# Altium project Keng Seng Task 2.PrjPcb
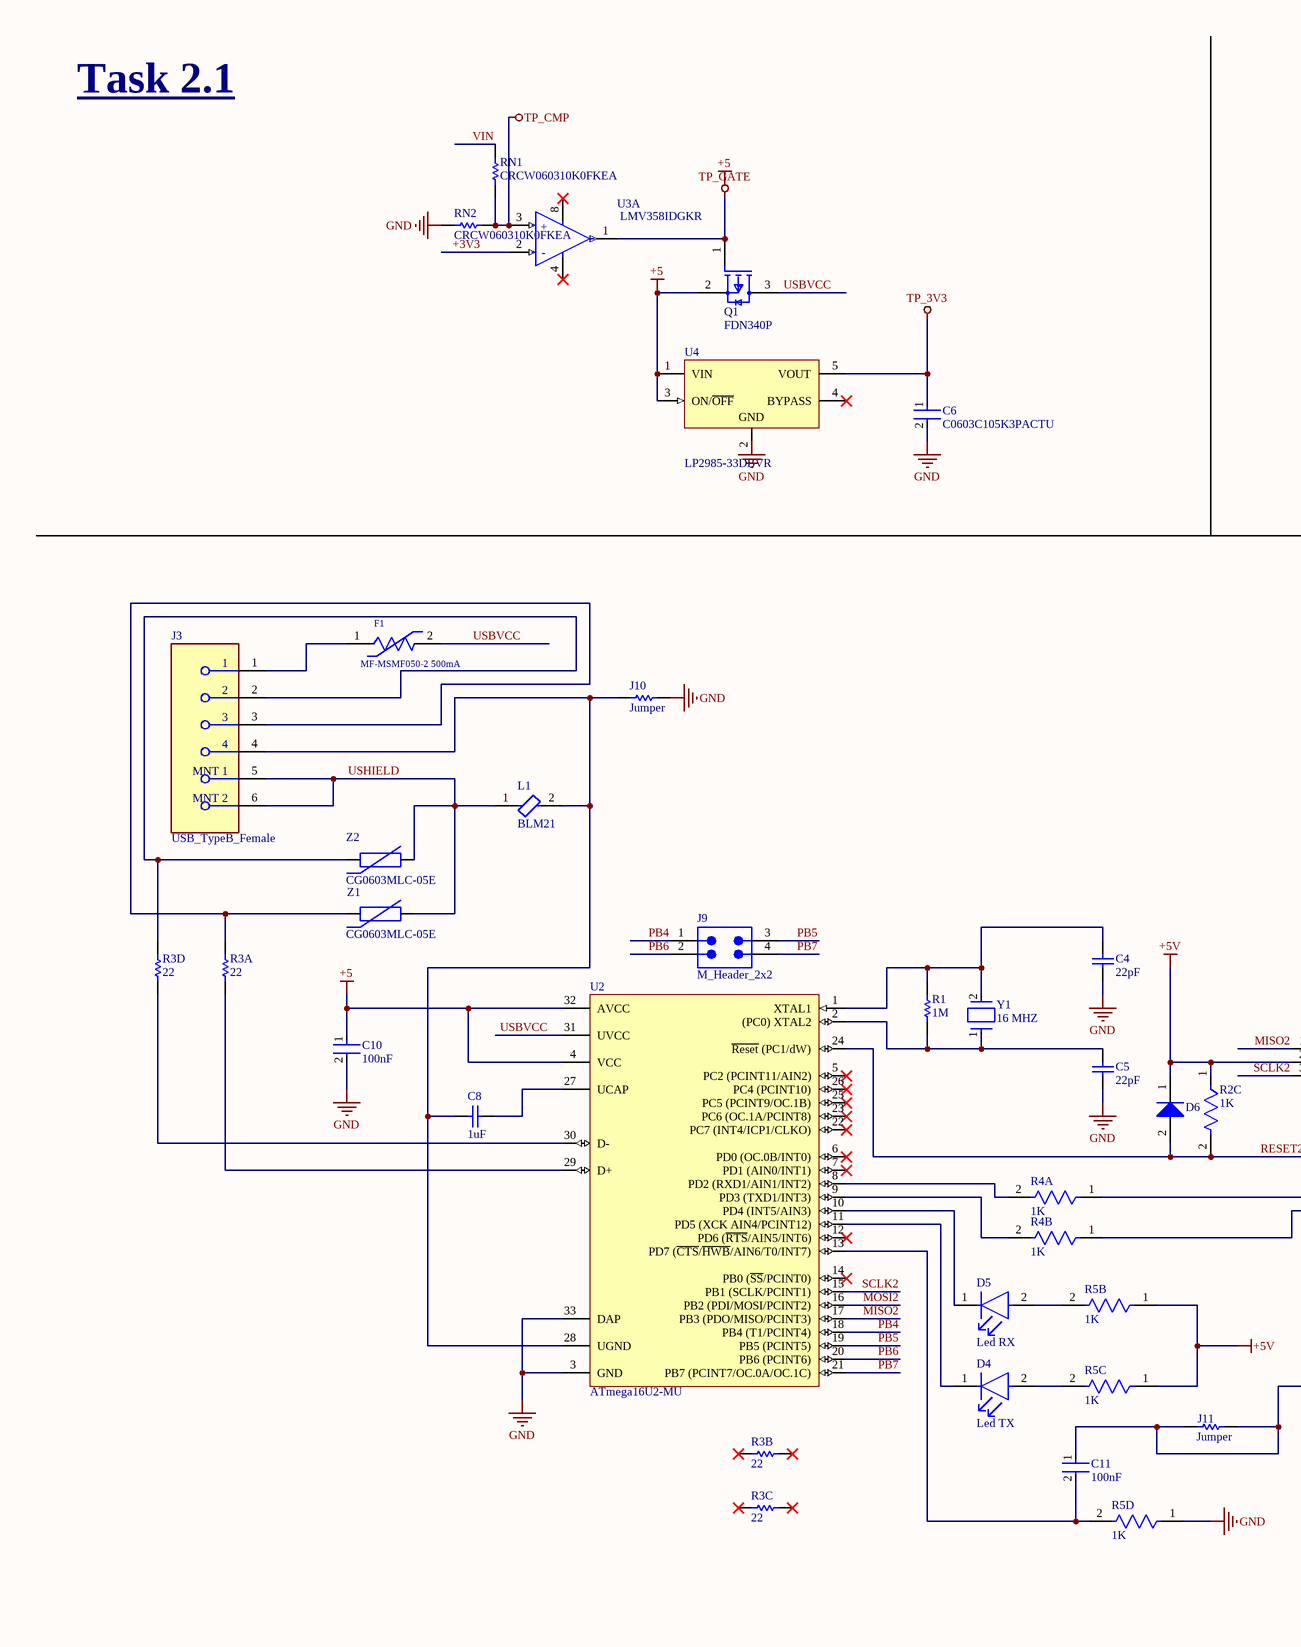
[diagram p0: Keng Seng Task 2.SchDoc, left]
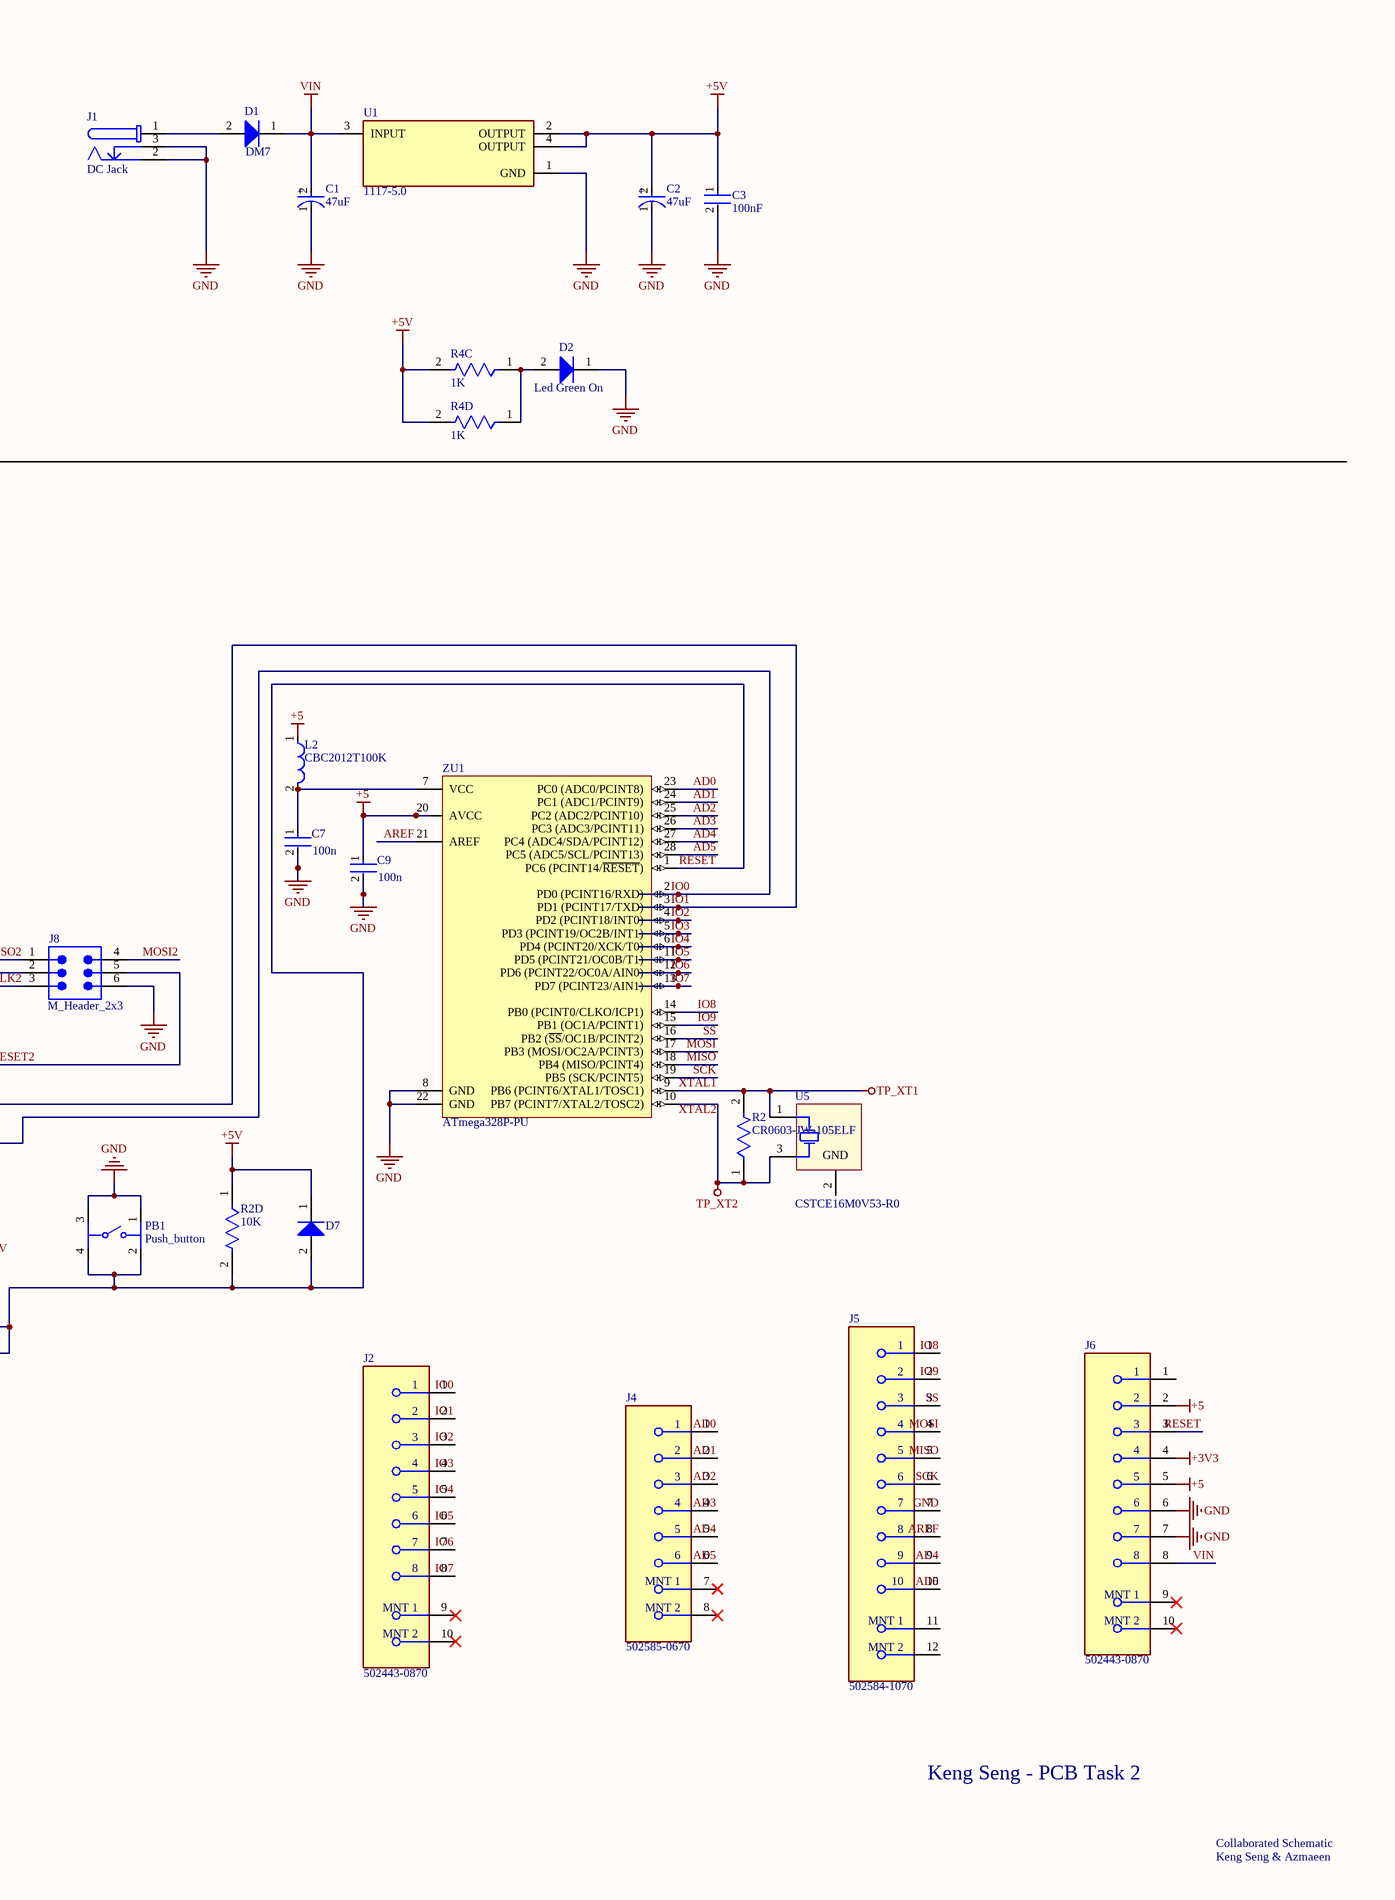
[diagram p1: Keng Seng Task 2.SchDoc, right]
1 sheet, 58 parts. Net scope: global (net labels, ports and power ports of the same name join across sheets).
Board file: Keng Seng Task 2.PcbDoc

## Sheet Keng Seng Task 2.SchDoc
size C; SheetNumber: 1; SheetTotal: 1

### Parts
C1  47uF  [FP-FPD-MFG]
C2  47uF  [FP-FPD-MFG]
C3  100nF  [FP-C0402-BB-MFG]
C4  22pF  [CAPC1608X90X35ML10T15]
C5  22pF  [CAPC1608X90X35ML10T15]
C6  C0603C105K3PACTU  [FP-C0603C105K3PACTU-MFG]
C7  100n  [FP-C0603-030-0_03-IPC_A]
C8  1uF  [CAPC2013X135X45LL10T25]
C9  100n  [FP-C0603-030-0_03-IPC_A]
C10  100nF  [FP-C0402-BB-MFG]
C11  100nF  [FP-C0402-BB-MFG]
D1  DM7  [ONSC-SOD-323-2-477-02_V]
D2  Led Green On  [ONSC-SOD-323-2-477-02_V]
D4  Led TX  [FP-LTST-C190GKT-MFG]
D5  Led RX  [FP-LTST-C190GKT-MFG]
D6  (no value)  [ONSC-SOD-323-2-477-02_V]
D7  (no value)  [ONSC-SOD-323-2-477-02_V]
F1  MF-MSMF050-2 500mA  [FP-MF-MSMF050-2-MFG]
J1  DC Jack  [694105309102]
J2  502443-0870  [FP-502443-0870-MFG]
J3  USB_TypeB_Female  [FP-1-1734346-1-MFG]
J4  502585-0670  [FP-502585-0670-MFG]
J5  502584-1070  [FP-502584-1070-MFG]
J6  502443-0870  [FP-502443-0870-MFG]
J8  M_Header_2x3  [66200621022]
J9  M_Header_2x2  [66200421022]
J10  Jumper  [RESC2013X50X30LL20T20]
J11  Jumper  [RESC2013X50X30LL20T20]
L1  BLM21  [FP-BLM21-0_2-t0_85-e0_5-MFG]
L2  CBC2012T100K  [FP-CB2012-IPC_A]
PB1  Push_button  [FP-PTS645SM43SMTR92LFS-MFG]
Q1  FDN340P  [FP-527AG-MFG]
R1  1M  [RESC3216X70X50NL05T20]
R2  CR0603-JW-105ELF  [FP-CR0603-IPC_A]
R2C  1K  [FP-CRCW0603-e3-MFG]
R2D  10K  [FP-CRCW0603-e3-MFG]
R3A  22  [RESC1005X40X25LL05T05]
R3B  22  [RESC1005X40X25LL05T05]
R3C  22  [RESC1005X40X25LL05T05]
R3D  22  [RESC1005X40X25LL05T05]
R4A  1K  [FP-CRCW0603-e3-MFG]
R4B  1K  [FP-CRCW0603-e3-MFG]
R4C  1K  [FP-CRCW0603-e3-MFG]
R4D  1K  [FP-CRCW0603-e3-MFG]
R5B  1K  [FP-CRCW0603-e3-MFG]
R5C  1K  [FP-CRCW0603-e3-MFG]
R5D  1K  [FP-CRCW0603-e3-MFG]
RN1  CRCW060310K0FKEA  [RESC1609X50X30NL8T20]
RN2  CRCW060310K0FKEA  [RESC1609X50X30NL8T20]
U1  1117-5.0  [FP-DCY0004A-IPC_A]
U2  ATmega16U2-MU  [32PG_N]
U3  LMV358IDGKR  [FP-DGK0008A-IPC_B]  (part A of 2)
U4  LP2985-33DBVR  [DBV0005A_M]
U5  CSTCE16M0V53-R0  [MURA-CSTCE_V-3_V]
Y1  16 MHZ  [FP-ABM7-MFG]
Z1  CG0603MLC-05E  [BOUR-CG0603-2_V]
Z2  CG0603MLC-05E  [BOUR-CG0603-2_V]
ZU1  ATmega328P-PU  [28P3]

### Nets
+3V3: J6.4 U3.2(1IN-)
+5: C9.1 C10.1 J6.2 J6.5 L2.1 Q1.2(S) U2.4(VCC) U2.32(AVCC) U4.1(VIN) U4.3(ON/~{OFF}) ZU1.20(AVCC)
+5V: C2.2(A) C3.1 D6.1(K) D7.1(K) J8.2 R2C.1 R2D.1 R4C.2 R4D.2 R5B.1 R5C.1 U1.2(OUTPUT) U1.4(OUTPUT)
GND: C1.1(C) C2.1(C) C3.2 C4.1 C5.1 C6.2 C7.2 C9.2 C10.2 D2.1(K) J1.2 J1.3 J5.7 J6.6 J6.7 J8.6 J10.1 PB1.1 PB1.3 R5D.1 RN2.1 U1.1(GND) U2.3(GND) U2.33(DAP) ZU1.8(GND) ZU1.22(GND)
TP_3V3: C6.1 U4.5(VOUT)
TP_CMP: RN1.1 RN2.2 U3.3(1IN+)
TP_GATE: Q1.1(G) U3.1(1OUT)
VIN: C1.2(A) D1.1(K) J6.8 RN1.2 U1.3(INPUT)
XTAL1: R2.2 U5.1(C1) ZU1.9(PB6_(PCINT6/XTAL1/TOSC1))  [also labelled TP_XT1]
XTAL2: R2.1 U5.3(C2) ZU1.10(PB7_(PCINT7/XTAL2/TOSC2))  [also labelled TP_XT2]
AD0: J4.1 ZU1.23(PC0_(ADC0/PCINT8))
AD1: J4.2 ZU1.24(PC1_(ADC1/PCINT9))
AD2: J4.3 ZU1.25(PC2_(ADC2/PCINT10))
AD3: J4.4 ZU1.26(PC3_(ADC3/PCINT11))
AD4: J4.5 J5.9 ZU1.27(PC4_(ADC4/SDA/PCINT12))
AD5: J4.6 J5.10 ZU1.28(PC5_(ADC5/SCL/PCINT13))
AREF: J5.8 ZU1.21(AREF)
IO0: J2.1 R4B.1 ZU1.2(PD0_(PCINT16/RXD))
IO1: J2.2 R4A.1 ZU1.3(PD1_(PCINT17/TXD))
IO2: J2.3 ZU1.4(PD2_(PCINT18/INT0))
IO3: J2.4 ZU1.5(PD3_(PCINT19/OC2B/INT1))
IO4: J2.5 ZU1.6(PD4_(PCINT20/XCK/T0))
IO5: J2.6 ZU1.11(PD5_(PCINT21/OC0B/T1))
IO6: J2.7 ZU1.12(PD6_(PCINT22/OC0A/AIN0))
IO7: J2.8 ZU1.13(PD7_(PCINT23/AIN1))
IO8: J5.1 ZU1.14(PB0_(PCINT0/CLKO/ICP1))
IO9: J5.2 ZU1.15(PB1_(OC1A/PCINT1))
MISO: J5.5 ZU1.18(PB4_(MISO/PCINT4))
MISO2: J8.1 U2.17(PB3_(PDO/MISO/PCINT3))
MOSI: J5.4 ZU1.17(PB3_(MOSI/OC2A/PCINT3))
MOSI2: J8.4 U2.16(PB2_(PDI/MOSI/PCINT2))
PB4: J9.1 U2.18(PB4_(T1/PCINT4))
PB5: J9.3 U2.19(PB5_(PCINT5))
PB6: J9.2 U2.20(PB6_(PCINT6))
PB7: J9.4 U2.21(PB7_(PCINT7/OC.0A/OC.1C))
RESET: C11.1 D7.2(A) J6.3 J11.1 J11.2 PB1.2 PB1.4 R2D.2 ZU1.1(PC6_(PCINT14/~{RESET}))
RESET2: D6.2(A) J8.5 R2C.2 U2.24(~{Reset}_(PC1/dW))
SCK: J5.6 ZU1.19(PB5_(SCK/PCINT5))
SCLK2: J8.3 U2.15(PB1_(SCLK/PCINT1))
SS: J5.3 ZU1.16(PB2_(~{SS}/OC1B/PCINT2))
USBVCC: F1.2 Q1.3(D) U2.31(UVCC)
USHIELD: J3.5(MNT_1) J3.6(MNT_2) L1.1 Z1.2 Z2.2
NetC4_2: C4.2 R1.2 U2.1(XTAL1) Y1.2
NetC5_2: C5.2 R1.1 U2.2((PC0)_XTAL2) Y1.1
NetC7_1: C7.1 L2.2 ZU1.7(VCC)
NetC8_1: C8.1 J3.4 J10.2 L1.2 U2.28(UGND)
NetC8_2: C8.2 U2.27(UCAP)
NetC11_2: C11.2 R5D.2 U2.13(PD7_(~{CTS}/~{HWB}/AIN6/T0/INT7))
NetD1_2: D1.2(A) J1.1
NetD2_2: D2.2(A) R4C.1 R4D.1
NetD4_1: D4.1(C) U2.11(PD5_(XCK_AIN4/PCINT12))
NetD4_2: D4.2(A) R5C.2
NetD5_1: D5.1(C) U2.10(PD4_(INT5/AIN3))
NetD5_2: D5.2(A) R5B.2
NetF1_1: F1.1 J3.1
NetJ3_2: J3.2 R3D.2 Z2.1
NetJ3_3: J3.3 R3A.1 Z1.1
NetR3A_2: R3A.2 U2.29(D+)
NetR3D_1: R3D.1 U2.30(D-)
NetR4A_2: R4A.2 U2.8(PD2_(RXD1/AIN1/INT2))
NetR4B_2: R4B.2 U2.9(PD3_(TXD1/INT3))

Not connected (* = marked no-connect by the designer): J2 9(MNT_1)* 10(MNT_2)*; J4 7(MNT_1)* 8(MNT_2)*; J5 11(MNT_1) 12(MNT_2); J6 1 9(MNT_1)* 10(MNT_2)*; R3B 1* 2*; R3C 1* 2*; U2 5(PC2_(PCINT11/AIN2))* 6(PD0_(OC.0B/INT0))* 7(PD1_(AIN0/INT1))* 12(PD6_(~{RTS}/AIN5/INT6))* 14(PB0_(~{SS}/PCINT0))* 22(PC7_(INT4/ICP1/CLKO))* 23(PC6_(OC.1A/PCINT8))* 25(PC5_(PCINT9/OC.1B))* 26(PC4_(PCINT10))*; U3 4(GND)* 8(VCC+)*; U4 2(GND) 4(BYPASS)*; U5 2(GND)

### Notes on the sheet
- Task 2.1
- Keng Seng - PCB Task 2
- Keng Seng & Azmaeen
- Collaborated Schematic
- Labels drawn without touching a wire or pin: +5, GND
- (in symbol CMP-2000-06216-2) +
- (in symbol CMP-2100-03651-2, part A) +; -

### Library data of the parts
C1 C2 = CMP-2000-06216-2: CAP ALUM 47UF 20% 35V SMD; Life (Hours): 2000Hour; Leakage Current: 3uA; Dissipation Factor: 0.12%; Material: Aluminium; Ripple Current (AC): 300mA; ESR (Equivalent Series Resistance): 260mR; Construction: Cylindrical; Contact Plating: Tin; Termination: SMD/SMT; RoHS Compliant: Yes; Voltage Rating (DC): 35V; Package Quantity: 1; Tolerance: 20%; Mount: Surface Mount; Diameter: 6.3mm; Lead Free: Lead Free; Number of Pins: 2; Radiation Hardening: No; Series: FP; REACH SVHC: No SVHC; Length: 5.8mm; Height - Seated (Max): 0.228inch; Capacitance: 47uF; Packaging: Tape and Reel; Voltage Rating: 35V; Min Operating Temperature: -55°C; Voltage: 35V; Case/Package: Radial; Max Operating Temperature: 105°C; Ripple Current: 300mA; Height: 5.8mm; Lead Pitch: 1.8mm
C3 C10 C11 = CMP-2008-02046-2: CAP CER 0.1UF 10V X5R 0402; Manufacturer: Kemet; Manufacturer Part Number: C0402C104K8PACTU; Material: Ceramic; Capacitance: 0.10 μF; Temperature Coefficient: 15%; Tolerance: 0.1; Value: 0.10 μF; Package: C0402-BB; Temperature: -55°C to +125°C; ComponentLink2Description: Datasheet; Temperature Characteristic: X5R; Device Class L1: Passive Components; Height: 0.55mm; Lead Free: Yes; ComponentLink2URL: https://content.kemet.com/datasheets/KEM_C1002_X7R_SMD.pdf; Device Class L2: Capacitors; Temperature Range Low: -55°C; Temperature Range High: +125°C; RoHS: TRUE; Octopart: https://octopart.com/c0402c104k8pactu-kemet-140039; Automotive: No; Mouser Description: Capacitor 100 nF 10 VDC 0402; Category: Cap; Voltage Rating: 10 V; Digikey Description: CAP CER 0.1UF 10V X5R 0402; Ipc Land Pattern Name: CAPC10050X50; Device Class L3: Ceramic Capacitors
C4 C5 = CMP-2000-04945-1: Chip Capacitor, 22 pF, +/- 5%, 50 V, -55 to 125 degC, 0603 (1608 Metric), RoHS, Tape and Reel; Manufacturer: Murata; Rated Voltage: 50V; Dielectric: C0G; Capacitance: 22pF; Manufacturer URL: http://www.murata.com/; Datasheet Version: Jul-06; Package Reference: 603; Tolerance (%): ±5%; Case Size/Dimension: 0603; Package Description: 2-Pin Surface Mount Device, Body 1.6 x 0.8 mm; Datasheet URL: https://datasheet.ciiva.com/11786/0900766b807a1cab-11786398.pdf
C6 = CMP-2006-02216-3: CAP CER 1UF 25V X5R 0603; Dielectric Material: Ceramic; Tolerance: 10%; Contact Plating: Tin; Number of Pins: 2; Lead Free: Lead Free; Depth: 0.8mm; Length: 1.6mm; Mount: Surface Mount; Case Code (Metric): 1608; Max Operating Temperature: 85°C; Voltage: 25V; Voltage Rating (DC): 25V; REACH SVHC: No SVHC; Height: 0.8mm; Series: C0603C; Case/Package: 0603; Case Code (Imperial): 0603; Capacitance: 1uF; RoHS Compliant: Yes; Dielectric: X5R; Packaging: Tape and Reel; Construction: Flat; Thickness: 0.034inch; Voltage Rating: 25V; Radiation Hardening: No; Width: 0.031inch; Min Operating Temperature: -55°C; Termination: SMD/SMT; Package Quantity: 4000
C7 C9 = CMP-08246-003527-1: Multilayer Ceramic Capacitors 100pF ±5% 50V C0G SMD 0201; Insulation Resistance: 10GR; Package Quantity: 1; Dielectric Material: Ceramic; Packaging: Tape and Reel; Thickness: 0.013inch; Mount: Surface Mount; Voltage Rating (DC): 50V; Construction: Flat; Series: C; Tolerance: 5%; Min Operating Temperature: -55°C; Weight: 6E-06oz; Dielectric: C0G; Length: 0.6mm; Termination: SMD/SMT; Voltage Rating: 50V; Voltage: 50V; Height: 0.3mm; Capacitance: 100pF; RoHS Compliant: Yes; Case Code (Imperial): 0201; Max Operating Temperature: 125°C; Case/Package: 0201; Lead Free: Lead Free; Width: 0.012inch; Number of Pins: 2; Case Code (Metric): 0603; Depth: 0.3mm
C8 = CMP-1036-04761-2: Manufacturer: Murata; Part Number: GRM21BR71H105KA12L
D1 D2 D6 D7 = CMP-1055-00462-1: Schottky Barrier Diode, 2-Pin SOD-323, Pb-Free, Tape and Reel; PartNumber: BAT54HT1G; Manufacturer: On Semiconductor; Configuration: Single; trr Max (ns): 5; IFSM Max (A): 0.6; ComponentLink3URL: http://www.onsemi.com/pub_link/Collateral/477-02.PDF.1; PackageDescription: 2-Pin SOD, Body 1.7 x 1.25 mm; ComponentLink2URL: http://www.onsemi.cn/pub_link/Collateral/BAT54HT1-D.PDF; ComponentLink3Description: Package Specification; ComponentLink2Description: Datasheet; DatasheetVersion: Rev. 6; PackageReference: SOD-323-2-477-02; RoHS: TRUE; ComponentLink1URL: http://www.onsemi.com/; Packing: Tape and Reel; Mounting Technology: Surface Mount; ComponentLink1Description: Manufacturer URL; PackageVersion: Rev. H, 03/2007
D4 D5 = CMP-22017-000005-2: LED GREEN CLEAR CHIP SMD; Dominant Wavelength: 569nm; Reverse Voltage: 5V; Lens Color: Colorless; Viewing Angle: 130°; Voltage: 2V; Forward Current: 30mA; Power Dissipation: 100mW; Luminous Intensity: 6mcd; Number of LEDs: 1; Forward Voltage: 2.1V; Wavelength: 565nm; Test Current: 10mA; Min Operating Temperature: -55°C; Lens Style: Clear; Mount: Surface Mount; Width: 0.8mm; Packaging: Tape and Reel; Lens Transparency: Clear; Case Code (Metric): 1608; Depth: 0.8mm; Case Code (Imperial): 0603; Case/Package: 0603; Number of Pins: 2; Max Operating Temperature: 85°C; Lead Free: Lead Free; Number of Elements: 1; Length: 1.6mm; Height: 0.8mm; Package Quantity: 1; Power Rating: 100mW; Radiation Hardening: No; Illumination Color: Green; Color: Green
F1 = CMP-2100-03653-2: PTC RESET FUSE 15V 500MA 1812; Manufacturer: Bourns; Value: 0.15-1Ω; Trip Current: 1A; Automotive Grade: Grade 3; Trip Time: 0.15s; Current Rating: 100A; Hold Current: 0.5A; Height: 0.85mm; Package: 1812; Voltage Rating: 15V; Temperature Range High: +85°C; Device Class L2: PTC Resettable Fuses; Lead Free: Yes; ComponentLink2URL: http://www.bourns.com/docs/Product-Datasheets/mfmsmf.pdf; Ambient Temperature Range High: +85°C; Mouser Description: PTC Resettable Fuse 0.5A(hold) 1A(trip) 15V 100A 0.8W 0.15s 0.15Ohm SMD Solder Pad 1812 T/R; Digikey Description: PTC RESET FUSE 15V 500MA 1812; Manufacturer Part Number: MF-MSMF050-2; Resistance: 0.15-1Ω; Category: Fuse; ComponentLink2Description: Datasheet; Automotive: Yes; Temperature Range Low: -40°C; RoHS: TRUE; Device Class L1: Circuit Protection; Temperature: -40°C to +85°C; Octopart: https://octopart.com/mf-msmf050-2-bourns-28047; Ambient Temperature Range Low: -40°C; Device Class L3: unset
J1 = CMP-1502-00187-2: NexarPartId: 52645182; Current Rating: 5.5A; Insulation Resistance: 100MΩ; Gender: Male; Connector Type: Power; Shielding: Shielded; Voltage Rating (DC): 20V; Contact Plating: Tin; Contact Gender: Female; Housing Material: Polyamide; Flammability Rating: UL94 V-0; RoHS: Compliant; Termination: Through Hole; Min Operating Temperature: -40°C; REACH SVHC: Unknown; Operating Supply Voltage: 20V; Voltage Rating: 20V; Mount: Through Hole; Max Operating Temperature: 85°C; Color: Black; Packaging: Tape and Reel
J2 J6 = CMP-00257-08030873-1: 502443-0870 2.00mm Pitch CLIK-Mate Wire-to-Board PCB Receptacle, Single Row, Vertical, 8 Circuits; Manufacturer Lifecycle Status: ACTIVE; Connector Type: Forked, Receptacle; Max Voltage Rating (DC): 250V; Number of Contacts: 8; Contact Resistance: 20mΩ; Plating: Tin; Current Rating: 3A; Glow Wire Compliant: Non-compliant; Pitch: 2mm; Insulation Resistance: 1GΩ; Flammability Rating: UL94 V-0; Mount: Surface Mount; Orientation: Vertical; Length: 20mm; Max Voltage Rating (AC): 250V; Contact Plating: Tin; Number of Positions: 8; NexarPartId: 8030873; Radiation Hardening: No; Lifecycle Status: Production; Termination: Solder; Housing Material: Thermoplastic; Voltage Rating (AC): 250V; Housing Color: Natural; Material: Polybutylene; Fastening Type: Latch; Depth: 6.85mm; Gender: Receptacle; Country of Origin: JP; Min Operating Temperature: -25°C; Color: Natural; Contact Gender: Female; Number of Rows: 1; Number of Pins: 8; RoHS: Compliant; Number of Circuits: 8; Packaging: Cut Tape; Schedule B: 8536694040; REACH SVHC: Unknown; Contact Material: Copper; Max Operating Temperature: 85°C
J3 = CMP-03360-000002-1: CONN RCPT USB2.0 TYPEB 4P SMD RA; Manufacturer: TE; Manufacturer Part Number: 1-1734346-1; Conn Orientation: Right Angle; Shielding: true; Number Of Contacts: 4; Voltage Rating: 30V; Standoff Height: 0mm; Current Rating: 1A; Is Female: yes; Pitch: 1.25mm; Digikey Description: CONN RCPT USB2.0 TYPEB 4P SMD RA; Mouser Description: USB Connectors R/A SMT B W/post BLK; RoHS: TRUE; Temperature Range Low: 0°C; Automotive: No; Device Class L3: unset; Contact Material: Gold,Nickel; Temperature: 0°C to +50°C; ComponentLink2Description: Datasheet; Octopart: https://octopart.com/1-1734346-1-te+connectivity-43171491; Device Class L2: USB Connectors; Device Class L1: Connectors; Height: 11.25mm; Usb Standard: USB 2.0; ComponentLink2URL: https://upverter.com/datasheet/fa2984cd0f06f842a1fb894b40a37fa21ddb7ad0.pdf; Package: 1-1734346-1; Lead Free: Yes; Temperature Range High: +50°C; Category: Conn
J4 = CMP-04776-000378-1: CONN RCPT 6POS 0.059 TIN SMD R/A; Number of Circuits: 6; Voltage Rating: 100V; Connector Type: Receptacle; Pitch: 1.5mm; Glow Wire Compliant: Non-compliant; Contact Resistance: 20mR; Current Rating: 2A; Housing Material: Resin; Contact Material: Copper Alloy; Package Quantity: 1000; Contact Type: Center Strip Contact; Depth: 7.3mm; Contact Plating: Tin; Case/Package: SIL; Radiation Hardening: No; Contact Gender: Female; Gender: Receptacle; Orientation: Right Angle; Length: 13.3mm; Number of Rows: 1; Max Operating Temperature: 85°C; Termination: Solder; Insulation Material: Resin; Mount: Surface Mount; Contact Finish - Mating: TIN; Packaging: Tape and Reel; Flammability Rating: UL94 V-0; Number of Contacts: 6; Fastening Type: Latch; Housing Color: Beige; Insulation Color: Beige; Series: CLIK-Mate™ 502585; Min Operating Temperature: -40°C; Number of Positions: 6; Color: Beige
J5 = CMP-00257-18669480-1: 502584-1070 1.5 W/B Sgl ST RecAssy10CktEmbsTpPkg; Manufacturer Lifecycle Status: ACTIVE; Pitch: 1.5mm; Gender: Receptacle; Connector Type: Center Strip Contact, Receptacle; Number of Circuits: 10; Voltage Rating: 100V; Current Rating: 2A; Glow Wire Compliant: Non-compliant; Min Operating Temperature: -40°C; Housing Material: Resin; NexarPartId: 18669480; RoHS: Compliant; Height: 7.5mm; Depth: 6.35mm; Case/Package: SIL; Max Operating Temperature: 85°C; Number of Pins: 10; Contact Plating: Tin; Housing Color: Beige; Contact Material: Copper, Tin; Mount: Surface Mount; Orientation: Vertical; Lifecycle Status: Production; REACH SVHC: Unknown; Number of Rows: 1; Country of Origin: JP; Length: 19.3mm; Number of Contacts: 10; Contact Gender: Female; Fastening Type: Latch; Number of Positions: 10; Packaging: Cut Tape; Radiation Hardening: No; Termination: Solder; Color: Beige
J8 = CMP-1502-00366-2: NexarPartId: 22865267; Row Spacing: 2.9972mm; Pitch: 3mm; Gender: Male; Operating Supply Voltage: 250V; Insulation Resistance: 1GΩ; Current Rating: 5A; Contact Resistance: 10mΩ; Number of Positions: 6; Connector Type: Male Pin, Socket; Number of Pins: 6; Width: 12.7mm; Fastening Type: Latch; Lead Pitch: 3mm; Length: 12.7mm; Contact Plating: Tin; Contact Material: Copper; Housing Material: Nylon; Height: 8.9mm; REACH SVHC: Unknown; Color: Black; Termination: Solder; Max Operating Temperature: 105°C; Mount: Through Hole; RoHS: Compliant; Number of Contacts: 6; Min Operating Temperature: -40°C; Number of Rows: 2
J9 = CMP-1502-00365-2: NexarPartId: 22865266; Pitch: 3mm; Number of Positions: 4; Current Rating: 5A; Gender: Male; Row Spacing: 2.9972mm; Contact Resistance: 10mΩ; Connector Type: Male Pin, Socket; Insulation Resistance: 1GΩ; Operating Supply Voltage: 250V; Min Operating Temperature: -40°C; Width: 9.7mm; Max Operating Temperature: 105°C; Housing Material: Nylon; Mount: Through Hole; Number of Contacts: 4; REACH SVHC: Unknown; Contact Plating: Tin; Termination: Solder; Height: 8.9mm; Number of Rows: 2; Lead Pitch: 3mm; Color: Black; Length: 9.7mm; RoHS: Compliant; Contact Material: Copper; Fastening Type: Ramp; Number of Pins: 4
J10 J11 = CMP-2001-04896-1: Manufacturer: Vishay Dale; Part Number: CRCW08050000Z0EA
L1 = CMP-0686-00639-3: Chip Ferrite Bead, 0805, 600Ω @ 100MHz, 0.2Ω, 25%, 700mA; Material: Steel; DC Current: 200mA; Impedance: 600R; Current Rating: 600mA; Number of Circuits: 1; Shielding: Unshielded; DC Resistance (DCR): 210mR; Temperature Coefficient: 10ppm/°C; Conductor Material: Copper; Radiation Hardening: No; Test Frequency: 100MHz; Height: 0.85mm; Max Current Rating: 700mA; REACH SVHC: No SVHC; Case Code (Metric): 2012; Max DC Current: 200mA; Min Operating Temperature: -55°C; ESR (Equivalent Series Resistance): 600R; Case/Package: 0805; Tolerance: 25%; Number of Pins: 2; Depth: 1.25mm; Lead Free: Lead Free; Frequency: 100MHz; Length: 2mm; Package Quantity: 1; Max Operating Temperature: 125°C; Case Code (Imperial): 0805; Width: 1.25mm; Core Material: Ferrite; RoHS Compliant: Yes; Termination: SMD/SMT; Number of Lines: 1; Packaging: Tape and Reel
L2 = CMP-14484-000331-1: SMD Inductors 10uH ±10% 0.34A 1.56Ω 0805; Saturation Current: 240mA; Current Rating: 340mA; Shielding: Unshielded; Self Resonant Frequency: 40MHz; DC Resistance (DCR): 1.56R; Core Material: Ferrite; Test Frequency: 2.52MHz; Halogen Free: Halogen Free; Min Operating Temperature: -40°C; Max Operating Temperature: 105°C; Package Quantity: 3000; Tolerance: 10%; Height: 1.25mm; Packaging: Tape and Reel; Case/Package: 0805; Series: CB; Termination: SMD/SMT; Case Code (Metric): 2012; Inductance: 10uH; Depth: 1.45mm; Height - Seated (Max): 0.057inch; Resistor Type: Wirewound; Case Code (Imperial): 0805; Max DC Current: 340mA; Width: 0.049inch; Radiation Hardening: No; Mount: Surface Mount; Inductance Tolerance: 10%; Length: 0.079inch
PB1 = CMP-2000-05160-2: SWITCH TACTILE SPST-NO 0.05A 12V; Contact Resistance: 100mR; Throw Configuration: SPST; Illumination Type: Non-Illuminated; Mechanical Life: 100000Cycles; Current Rating: 50mA; Switch Function: Off-Mom; Actuator Length: 0.85mm; Actuator Material: Nylon; Actuator Type: Standard; Operating Force: 160gf; Min Operating Temperature: -20°C; REACH SVHC: No SVHC; Termination: Gull Wing; Case/Package: SMD/SMT; Packaging: Tape and Reel; Mount: Surface Mount; Voltage Rating (DC): 12V; Orientation: Straight; Lead Free: Lead Free; Contact Material: Silver; Color: Black; Max Current Rating: 50mA; Contact Plating: Silver; Depth: 9mm; Package Quantity: 1; Max Voltage Rating (DC): 12V; Length: 6mm; Max Operating Temperature: 60°C
Q1 = CMP-2100-03638-2: MOSFET P-CH 20V 2A SSOT3; Fall Time: 11ns; Rise Time: 9ns; Voltage Rating (DC): -20V; Power Dissipation: 500mW; Nominal Vgs: -800mV; Current Rating: -2A; Gate to Source Voltage (Vgs): 8V; Rds On Max: 70mR; Turn-Off Delay Time: 27ns; Element Configuration: Single; Number of Elements: 1; Input Capacitance: 779pF; Drain to Source Resistance: 60mR; Turn-On Delay Time: 10ns; Package Quantity: 1; Mount: Surface Mount; Case/Package: SOT-23; Min Operating Temperature: -55°C; REACH SVHC: No SVHC; Weight: 0.03g; Packaging: Tape and Reel; Threshold Voltage: -800mV; Max Operating Temperature: 150°C; Dual Supply Voltage: -20V; Termination: SMD/SMT; Drain to Source Voltage (Vdss): 20V; Height: 0.94mm; Length: 2.92mm; Contact Plating: Tin; Width: 3.05mm; Drain to Source Breakdown Voltage: -20V; Max Power Dissipation: 500mW; Continuous Drain Current (ID): 2A; Number of Pins: 3; Lead Free: Lead Free; Radiation Hardening: No; On-State Resistance: 70MR
R1 = CMP-2003-00541-1: Manufacturer: Panasonic; Part Number: ERJ-8GEY0R00V
R2 = CMP-1012-00146-2: Thick Film Chip Resistors 0603 1MΩ 0.1W 5% 200ppm/°C; Power Rating: 100mW; Resistance: 1MR; Voltage Rating: 50V; Thickness: 457um; Case Code (Metric): 1608; Features: Moisture Resistant; Packaging: Tape and Reel; Max Power Dissipation: 100mW; Composition: Thick Film; Military Standard: Not; Height: 0.022inch; Case/Package: 0603; Width: 0.031inch; Termination: SMD/SMT; Min Operating Temperature: -55°C; Package Quantity: 1; Length: 1.6mm; Case Code (Imperial): 0603; Temperature Coefficient: 200ppm/°C; Tolerance: 5%; Contact Plating: Tin; Depth: 0.8mm; Max Operating Temperature: 155°C; Number of Terminations: 2; Mount: Surface Mount; Radiation Hardening: No
R2C R2D R4A R4B R4C R4D R5B R5C R5D = CMP-1666-00003-5: RES Thick Film, 1kΩ, 1%, 0.1W, 100ppm/°C, 0603; Max Power Dissipation: 100mW; Voltage Rating: 75V; Resistance: 1kR; Max Operating Temperature: 155°C; Number of Pins: 2; Case Code (Imperial): 0603; Width: 0.033inch; Power Rating: 100mW; Number of Terminations: 2; Package Quantity: 10; Weight: 7.1E-05oz; Tolerance: 1%; Temperature Coefficient: 100ppm/°C; Military Standard: Not; Mount: Surface Mount; Voltage Rating (DC): 75V; Depth: 0.85mm; Composition: Thick Film; Radiation Hardening: No; Termination: SMD/SMT; Length: 1.55mm; Case Code (Metric): 1608; Contact Plating: Tin; Min Operating Temperature: -55°C; Packaging: Tape and Reel; Height: 0.45mm; Lead Free: Lead Free; Case/Package: 0603; Features: Automotive AEC-Q200
R3A R3B R3C R3D = CMP-2002-08382-1: Manufacturer: Vishay Dale; Part Number: CRCW040222R0FKED
RN1 RN2 = CMP-1666-00005-4: Chip Resistor, 10 KOhm, +/- 1%, 100 mW, -55 to 155 degC, 0603 (1608 Metric), RoHS, Tape and Reel; Manufacturer: Vishay Semiconductor; Voltage Rating: 75 V; Max Operating Temperature: 155 degC; PackageDescription: 2-Pin Surface Mount Device, Body 1.575 x 0.85 mm; ComponentLink1Description: Manufacturer URL; RoHSCompliant: true; PackageReference: 0603; REACH SVHC: Unknown; Length: 1.55 mm; DatasheetVersion: 06/2012; Packaging: Tape and Reel; Min Operating Temperature: -55 degC; Mounting Technology: Surface Mount; ComponentLink2URL: https://datasheet.ciiva.com/11809/0900766b80d98afc-11809037.pdf; Height: 0.45 mm; ComponentLink2Description: Datasheet; Package Quantity: 5000; ComponentLink1URL: http://www.vishay.com/
U1 = CMP-04917-000165-1: IC REG LINEAR 5V 800MA SOT223-4; Quiescent Current: 15mA; Reference Voltage: 5.2V; Number of Outputs: 1; Input Bias Current: 5mA; Polarity: Positive; Min Input Voltage: 6.4V; Output Type: Fixed; Dropout Voltage: 1.2V; Max Input Voltage: 15V; REACH SVHC: No SVHC; Radiation Hardening: No; Width: 3.7mm; Length: 6.7mm; Min Operating Temperature: -40°C; Packaging: Rail/Tube; Number of Regulators: 1; Package Quantity: 80; Output Current: 800mA; RoHS Compliant: Yes; Case/Package: SOT-223; Min Current Limit: 800mA; Number of Pins: 3; Output Voltage: 5V; Max Output Current: 800mA; Nominal Output Voltage: 5V; Lead Free: Lead Free; Series: -; Mount: Surface Mount; Max Operating Temperature: 125°C; Height: 1.7mm
U2 = CMP-0095-00115-3: 8-bit AVR Microcontroller, 2.7-5.5V, 16KB Flash, 512 Bytes EEPROM, 512 Bytes SRAM, 32-pin VQFN, Industrial Grade (-40°C to 85°C); ComponentLink1Description: Manufacturer URL; RevisionNote: Schematic symbol corrected; ComponentLink3URL: http://www.atmel.com/dyn/resources/prod_documents/7799S.pdf; ComponentLink2URL: http://www.atmel.com/dyn/resources/prod_documents/doc7799.pdf; PackageReference: 32PG; DatasheetVersion: revD, Nov-2010; PartNumber: ATmega16U2-MU; PackageVersion: revA, Oct-2008; Code_JEDEC: MO-220WHHD-2; PackageDescription: 32-Pin Quad Flat No-Lead (QFN) Sawn,  5 x 5 x 1.0 mm Body, Pitch 0.50 mm, 3.60mm Exposed Pad; ComponentLink2Description: ATmega8U2/16U2/32U2 Datasheet; ComponentLink1URL: http://www.atmel.com/; ComponentLink3Description: ATmega8U2/16U2/32U2 Summary
U3 = CMP-2100-03651-2: IC OPAMP GP 2 CIRCUIT 8VSSOP; Operating Supply Current: 210uA; Number of Channels: 2; Common Mode Rejection Ratio: 50dB; Input Offset Voltage (Vos): 7mV; Slew Rate: 1V/µs; Output Current: 160mA; Nominal Supply Current: 440uA; Voltage Gain: 100dB; Input Bias Current: 250nA; Gain Bandwidth Product: 1MHz; Min Supply Voltage: 2.7V; Max Supply Voltage: 5.5V; Mount: Surface Mount; Packaging: Tape and Reel; Length: 3mm; Package Quantity: 1; Min Operating Temperature: -40°C; Width: 3mm; Height: 0.97mm; Max Operating Temperature: 125°C; REACH SVHC: No SVHC; Radiation Hardening: No; Power Supply Rejection Ratio (PSRR): 50dB; Lead Free: Lead Free; Case/Package: MSOP; Contact Plating: Gold; Number of Circuits: 2; Unity Gain Bandwidth Product: 1MHz; Number of Pins: 8; Bandwidth: 1MHz; Output Current per Channel: 160mA; Number of Amplifiers: 2; Number of Elements: 2
U4 = CMP-0758-00080-2: Single Output Low Noise LDO, 150 mA, Fixed 3.3 V Output, 1.5% Tolerance, 2.2 to 16 V Input, Low IQ, 5-Pin SOT-23 (DBV), -40 to 125 degC, Green (RoHS & no Sb/Br), Tape and Reel; Manufacturer: Texas Instruments; Vdo (Typ) (mV): 280; Accuracy (%): 1.5; Output Options: Fixed Output; Fixed Output Options (V): 3.3; Iout (Max) (A): 0.15; Iq (Typ) (mA): 0.85; ComponentLink3Description: Package Specification; Packing: Tape and Reel; ComponentLink3URL: http://www.ti.com/litv/pdf/mpds018j; Vin (V): 2.2 to 16; Mounting Technology: Surface Mount; ComponentLink1URL: http://www.ti.com/; PartNumber: LP2985-33DBVR; PackageReference: DBV0005A; ComponentLink2URL: http://www.ti.com/lit/ds/symlink/lp2985-50.pdf; RoHS: TRUE; ComponentLink2Description: Datasheet; PackageVersion: 4073253-4/L; Operating Temperature Range (degC): -40 to 125; DatasheetVersion: SLVS522N; ComponentLink1Description: Manufacturer URL; PackageDescription: 5-Pin Plastic Small Outline, Body 2.9 x 1.6 mm, Pitch 0.95 mm
U5 = CMP-0588-00001-2: Ceramic Resonator, 16 MHz with Built-in Capacitance, Thickness Expander Mode, Initial Frequency Tolerance +/- 0.5%, Load Capacity 15 pF, -20 to 80 degC, 3.2 x 1.3 x 1 mm SMD, RoHS, Reel; Manufacturer: Murata; Oscillating Frequency: 16 MHz; Load Capacity: 15 pF; PackageDescription: 3-Pin SMD, Body 3.2 x 1.3 mm, Pitch 0.95 mm; Mounting Technology: Surface Mount; ComponentLink1URL: http://www.murata.com/; RoHS: TRUE; Packing: Reel; Initial Frequency Tolerance: +/- 0.5%; PartNumber: CSTCE16M0V53-R0; ComponentLink2Description: Datasheet; DatasheetVersion: Rev. P16E-22; PackageReference: CSTCE_V-3; Operating Temperature Range: -20 to 80 degC; ComponentLink2URL: http://www.murata.com/products/catalog/pdf/p16e.pdf; ComponentLink1Description: Manufacturer URL; Initial Tolerance: +/- 0.5%
Y1 = CMP-27762-000095-1: Crystal 16MHz ±20ppm 18pF SMD-2 6mm x 3.5mm; ESR (Equivalent Series Resistance): 50R; Frequency Stability: 30ppm; Width: 3.3mm; Frequency: 16MHz; Radiation Hardening: No; Height: 0.055inch; Tolerance: 20ppm; Length: 6mm; Case/Package: CSMD; Lead Free: Lead Free; Min Operating Temperature: -40°C; Termination: SMD/SMT; Operating Frequency: 16 MHz; Resistor Type: Ceramic; Packaging: Tape and Reel; Mount: Surface Mount; Load Capacitance: 18pF; Frequency Tolerance: 20ppm; Depth: 3.5mm; Series: ABM7; Package Quantity: 1000; Max Operating Temperature: 85°C; Number of Pins: 2
Z1 Z2 = CMP-0584-00001-2: ESD Protector, 5 V Supply, -40 to 85 degC, 1.6 x 0.8 x 0.55 mm SMD, RoHS, Tape and Reel; Manufacturer: Bourns; VC: 20 V; VT: 150 V; RT: 1 ns; VDC: 5 V; CO: 0.5 pF; PartNumber: CG0603MLC-05E; ComponentLink1Description: Manufacturer URL; ComponentLink1URL: http://www.bourns.com/; Packing: Tape and Reel; Mounting Technology: Surface Mount; ComponentLink2Description: Datasheet; RoHS: TRUE; Operating Temperature: -40 to 85 degC; DatasheetVersion: Rev. S; PackageDescription: 2-Pin SMD, Body 1.6 x 0.8 mm, Pitch 1.52 mm; PackageReference: CG0603-2; ComponentLink2URL: http://www.bourns.com/data/global/pdfs/MLC.pdf
ZU1 = CMP-0095-00013-2: 8-bit AVR Microcontroller, 32KB Flash, 1KB EEPROM, 2KB SRAM, 28-pin PDIP, Industrial Grade (-40°C to 85°C); RevisionNote: DatasheetVersion updated. URLs added.; PackageVersion: revB, Sep-2001; PackageDescription: 28-lead (0.300"/7.62mm Wide) Plastic Dual Inline Package (PDIP); DatasheetVersion: revD, May-2011; ComponentLink1Description: Manufacturer URL; ComponentLink1URL: http://www.atmel.com/; PackageReference: 28P3; ComponentLink2Description: ATmega48A/48PA/88A/88PA/168A/168PA/328/328P Datasheet; ComponentLink3URL: http://www.atmel.com/dyn/resources/prod_documents/8271S.pdf; ComponentLink2URL: http://www.atmel.com/dyn/resources/prod_documents/8271.pdf; ComponentLink3Description: ATmega48A/48PA/88A/88PA/168A/168PA/328/328P Summary